# EAGLE schematic vga_fpga (EAGLE 9.3.0)
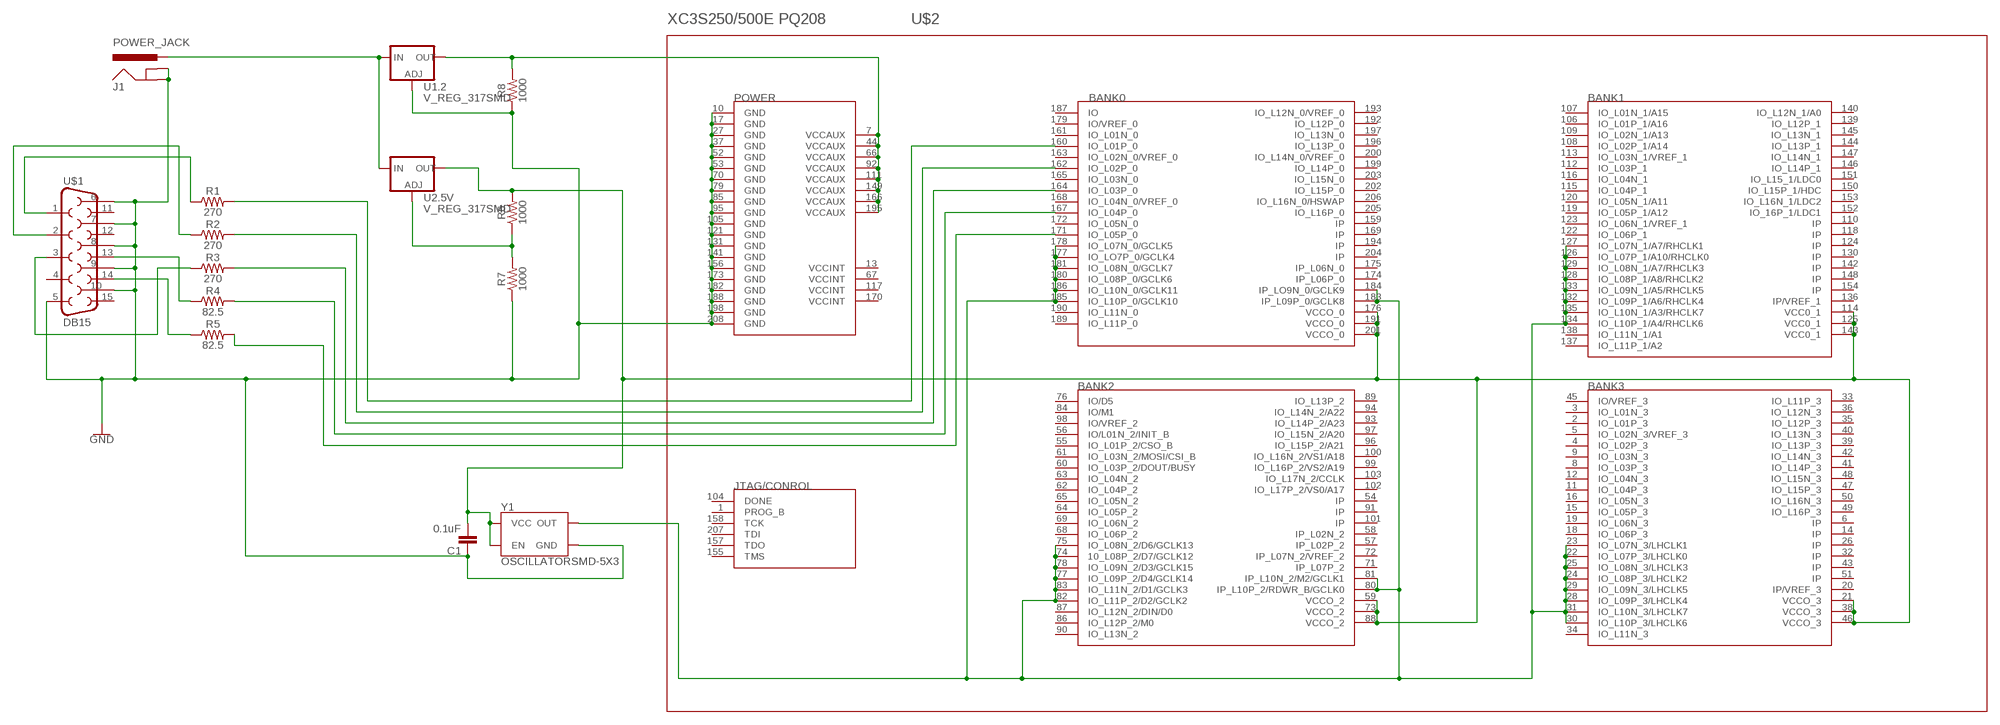
[diagram p0: schematic, sheet 1]

## Parts
C1  0.1uF  0.1UF-0603-25V-(+80/-20%)  [0603]
J1  POWER_JACK  [POWER_JACK_PTH]
R1  270  RESISTOR0603  [0603]
R2  270  RESISTOR0603  [0603]
R3  270  RESISTOR0603  [0603]
R4  82.5  RESISTOR0603  [0603]
R5  82.5  RESISTOR0603  [0603]
R6  1000  RESISTOR0603  [0603]
R7  1000  RESISTOR0603  [0603]
R8  1000  RESISTOR0603  [0603]
U1.2  V_REG_317SMD  [SOT223]
U2.5V  V_REG_317SMD  [SOT223]
U$1  DB15  [DB15]
U$2  XC3S250/500E-PQ208  [PQ208]
Y1  OSCILLATORSMD-5X3  [OSCILLATOR-SMD-5X3.2]

## Nets
GND: C1.1 J1.GND J1.GNDBREAK R7.1 R8.1 U1.2.1(ADJ) U$1.5 U$1.6 U$1.7 U$1.8 U$1.9 U$1.10 U$2.10(GND) U$2.17(GND) U$2.27(GND) U$2.37(GND) U$2.52(GND) U$2.53(GND) U$2.70(GND) U$2.79(GND) U$2.85(GND) U$2.95(GND) U$2.105(GND) U$2.121(GND) U$2.131(GND) U$2.141(GND) U$2.156(GND) U$2.173(GND) U$2.182(GND) U$2.188(GND) U$2.198(GND) U$2.208(GND) Y1.2(GND)
N$1: J1.PWR U1.2.3(IN) U2.5V.3(IN)
N$2: R8.2 U1.2.2(OUT) U$2.7(VCCAUX) U$2.44(VCCAUX) U$2.66(VCCAUX) U$2.92(VCCAUX) U$2.111(VCCAUX) U$2.149(VCCAUX) U$2.166(VCCAUX) U$2.195(VCCAUX)
N$3: R1.1 U$1.1
N$4: R2.1 U$1.2
N$5: R6.1 R7.2 U2.5V.1(ADJ)
N$6: C1.2 R6.2 U2.5V.2(OUT) U$2.21(VCCO_3) U$2.38(VCCO_3) U$2.46(VCCO_3) U$2.59(VCCO_2) U$2.73(VCCO_2) U$2.88(VCCO_2) U$2.114(VCC0_1) U$2.125(VCC0_1) U$2.143(VCC0_1) U$2.176(VCCO_0) U$2.191(VCCO_0) U$2.201(VCCO_0) Y1.1(EN) Y1.4(VCC)
N$7: R3.1 U$1.3
N$8: R4.1 U$1.13
N$9: R5.1 U$1.14
N$10: R1.2 U$2.160(IO_L01P_0)
N$11: R2.2 U$2.162(IO_L02P_0)
N$12: R3.2 U$2.164(IO_L03P_0)
N$13: R4.2 U$2.167(IO_L04P_0)
N$14: R5.2 U$2.171(IO_L05P_0)
N$20: U$2.22(IO_L07P_3/LHCLK0) U$2.23(IO_L07N_3/LHCLK1) U$2.24(IO_L08P_3/LHCLK2) U$2.25(IO_L08N_3/LHCLK3) U$2.28(IO_L09P_3/LHCLK4) U$2.29(IO_L09N_3/LHCLK5) U$2.30(IO_L10P_3/LHCLK6) U$2.31(IO_L10N_3/LHCLK7) U$2.74(10_L08P_2/D7/GCLK12) U$2.75(IO_L08N_2/D6/GCLK13) U$2.77(IO_L09P_2/D4/GCLK14) U$2.78(IO_L09N_2/D3/GCLK15) U$2.80(IP_L10P_2/RDWR_B/GCLK0) U$2.81(IP_L10N_2/M2/GCLK1) U$2.82(IO_L11P_2/D2/GCLK2) U$2.83(IO_L11N_2/D1/GCLK3) U$2.126(IO_L07P_1/A10/RHCLK0) U$2.127(IO_L07N_1/A7/RHCLK1) U$2.128(IO_L08P_1/A8/RHCLK2) U$2.129(IO_L08N_1/A7/RHCLK3) U$2.132(IO_L09P_1/A6/RHCLK4) U$2.133(IO_L09N_1/A5/RHCLK5) U$2.134(IO_L10P_1/A4/RHCLK6) U$2.135(IO_L10N_1/A3/RHCLK7) U$2.177(IO_LO7P_0/GCLK4) U$2.178(IO_L07N_0/GCLK5) U$2.180(IO_L08P_0/GCLK6) U$2.181(IO_L08N_0/GCLK7) U$2.183(IP_L09P_0/GCLK8) U$2.184(IP_LO9N_0/GCLK9) U$2.185(IO_L10P_0/GCLK10) U$2.186(IO_L10N_0/GCLK11) Y1.3(OUT)
Unconnected: U$1.4 U$1.11 U$1.12 U$1.15 U$2.1(PROG_B) U$2.2(IO_L01P_3) U$2.3(IO_L01N_3) U$2.4(IO_L02P_3) U$2.5(IO_L02N_3/VREF_3) U$2.6(IP) U$2.8(IO_L03P_3) U$2.9(IO_L03N_3) U$2.11(IO_L04P_3) U$2.12(IO_L04N_3) U$2.13(VCCINT) U$2.14(IP) U$2.15(IO_L05P_3) U$2.16(IO_L05N_3) U$2.18(IO_L06P_3) U$2.19(IO_L06N_3) U$2.20(IP/VREF_3) U$2.26(IP) U$2.32(IP) U$2.33(IO_L11P_3) U$2.34(IO_L11N_3) U$2.35(IO_L12P_3) U$2.36(IO_L12N_3) U$2.39(IO_L13P_3) U$2.40(IO_L13N_3) U$2.41(IO_L14P_3) U$2.42(IO_L14N_3) U$2.43(IP) U$2.45(IO/VREF_3) U$2.47(IO_L15P_3) U$2.48(IO_L15N_3) U$2.49(IO_L16P_3) U$2.50(IO_L16N_3) U$2.51(IP) U$2.54(IP) U$2.55(IO_L01P_2/CSO_B) U$2.56(IO/L01N_2/INIT_B) U$2.57(IP_L02P_2) U$2.58(IP_L02N_2) U$2.60(IO_L03P_2/DOUT/BUSY) U$2.61(IO_L03N_2/MOSI/CSI_B) U$2.62(IO_L04P_2) U$2.63(IO_L04N_2) U$2.64(IO_L05P_2) U$2.65(IO_L05N_2) U$2.67(VCCINT) U$2.68(IO_L06P_2) U$2.69(IO_L06N_2) U$2.71(IP_L07P_2) U$2.72(IP_L07N_2/VREF_2) U$2.76(IO/D5) U$2.84(IO/M1) U$2.86(IO_L12P_2/M0) U$2.87(IO_L12N_2/DIN/D0) U$2.89(IO_L13P_2) U$2.90(IO_L13N_2) U$2.91(IP) U$2.93(IO_L14P_2/A23) U$2.94(IO_L14N_2/A22) U$2.96(IO_L15P_2/A21) U$2.97(IO_L15N_2/A20) U$2.98(IO/VREF_2) U$2.99(IO_L16P_2/VS2/A19) U$2.100(IO_L16N_2/VS1/A18) U$2.101(IP) U$2.102(IO_L17P_2/VS0/A17) U$2.103(IO_L17N_2/CCLK) U$2.104(DONE) U$2.106(IO_L01P_1/A16) U$2.107(IO_L01N_1/A15) U$2.108(IO_L02P_1/A14) U$2.109(IO_L02N_1/A13) U$2.110(IP) U$2.112(IO_L03P_1) U$2.113(IO_L03N_1/VREF_1) U$2.115(IO_L04P_1) U$2.116(IO_L04N_1) U$2.117(VCCINT) U$2.118(IP) U$2.119(IO_L05P_1/A12) U$2.120(IO_L05N_1/A11) U$2.122(IO_L06P_1) U$2.123(IO_L06N_1/VREF_1) U$2.124(IP) U$2.130(IP) U$2.136(IP/VREF_1) U$2.137(IO_L11P_1/A2) U$2.138(IO_L11N_1/A1) U$2.139(IO_L12P_1) U$2.140(IO_L12N_1/A0) U$2.142(IP) U$2.144(IO_L13P_1) U$2.145(IO_L13N_1) U$2.146(IO_L14P_1) U$2.147(IO_L14N_1) U$2.148(IP) U$2.150(IO_L15P_1/HDC) U$2.151(IO_L15_1/LDC0) U$2.152(IO_16P_1/LDC1) U$2.153(IO_L16N_1/LDC2) U$2.154(IP) U$2.155(TMS) U$2.157(TDO) U$2.158(TCK) U$2.159(IP) U$2.161(IO_L01N_0) U$2.163(IO_L02N_0/VREF_0) U$2.165(IO_L03N_0) U$2.168(IO_L04N_0/VREF_0) U$2.169(IP) U$2.170(VCCINT) U$2.172(IO_L05N_0) U$2.174(IP_L06P_0) U$2.175(IP_L06N_0) U$2.179(IO/VREF_0) U$2.187(IO) U$2.189(IO_L11P_0) U$2.190(IO_L11N_0) U$2.192(IO_L12P_0) U$2.193(IO_L12N_0/VREF_0) U$2.194(IP) U$2.196(IO_L13P_0) U$2.197(IO_L13N_0) U$2.199(IO_L14P_0) U$2.200(IO_L14N_0/VREF_0) U$2.202(IO_L15P_0) U$2.203(IO_L15N_0) U$2.204(IP) U$2.205(IO_L16P_0) U$2.206(IO_L16N_0/HSWAP) U$2.207(TDI)

## Library data of the parts
C1 = SparkFun-Capacitors:0.1UF: 0.1µF ceramic capacitors A capacitor is a passive two-terminal electrical component used to store electrical energy temporarily in an electric field.; PROD_ID: CAP-00810
J1 = SparkFun-Connectors:POWER_JACK: Power Jack Connector This is the standard 5.5mm barrel jack for power. The PTH is the most common, proven, reliable, footprint. The Slot footprint only works if the mill layer is transmitted to the PCB fab house so be warned. Here are the connectors we sell at SparkFun: DC Barrel Power Jack/Connector <https://www.sparkfun.com/products/119> (PRT-00119) DC Barrel Power Jack/Connector (SMD) <https://www.sparkfun.com/products/12748> (PRT-12748) DC Barrel Jack Adapter - Breadboard Compatible <https://www.sparkfun.com/products/10811> (PRT-10811) It is used on this SparkFun product (and many, many others): SparkFun RedBoard - Programmed with Arduino <https://www.sparkfun.com/products/12757> (DEV-12757) Also, if you need a mating power supply or connector, please check these out: Wall Adapter Power Supply - 9VDC 650mA <https://www.sparkfun.com/products/298> (TOL-00298) DC Barrel Jack Adapter - Male <https://www.sparkfun.com/products/10287> (PRT-10287); PROD_ID: CONN-08197
R1-R8 = SparkFun-Resistors:RESISTOR: Generic Resistor Package
U1.2 U2.5V = SparkFun-IC-Power:V_REG_317: Voltage Regulator Standard LM317 adjustable voltage regulator. AOI (Adjust Output Input). Google 'LM317 Calculator' for easy to use app to get the two resistor values needed. 240/720 for 5V output. 240/390 for 3.3V output. Spark Fun Electronics SKU : COM-00527
U$1 = SparkFun-Retired:DB15: DB15 / VGA right angle through-hole female connector.
U$2 = SparkFun-Retired:XC3S250/500E-PQ208: Xilinx Spartan3E FPGA Not in catalog
Y1 = SparkFun-Clocks:OSCILLATOR: Oscillators (Generic) These are active oscillators, which require a power source to generate their clock output. Most oscillators are configured to generate a set frequency (e.g. 16MHz). They have four pins: power, ground, output, and an enable input.